# Altium schematic sheet 无极性旋钮.SchDoc
size B; SheetNumber: 4; SheetTotal: 14
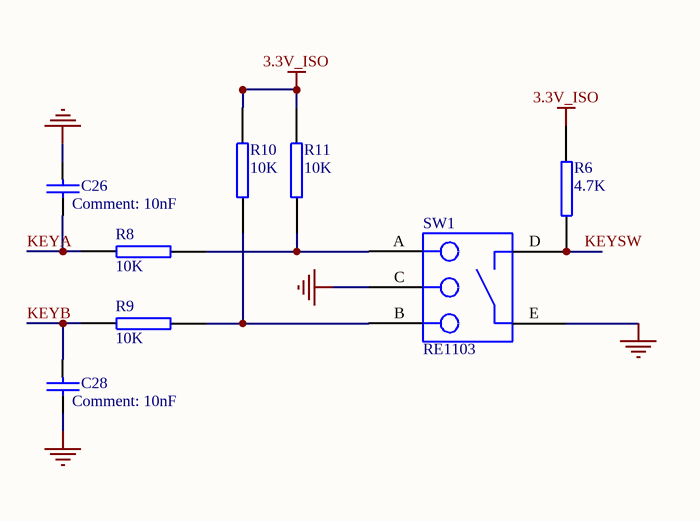
[diagram p0: 无极性旋钮.SchDoc]

## Parts
C26  10nF  [0603C]
C28  10nF  [0603C]
R6  4.7K  [0603R]
R8  10K  [0603R]
R9  10K  [0603R]
R10  10K  [0603R]
R11  10K  [0603R]
SW1  RE1103  [EX1103S-D2-10]

## Nets
3.3V_ISO: R6.1 R10.2 R11.2
GND: C26.1 C28.2 SW1.C SW1.E
KEYA: C26.2 R8.1
KEYB: C28.1 R9.1
KEYSW: R6.2 SW1.D
NetR8_2: R8.2 R11.1 SW1.A
NetR9_2: R9.2 R10.1 SW1.B

## Library data of the parts
C26 C28 = CAP: Capacitor
R6 R8-R11 = RES2